# EAGLE design Combined MXP board (EAGLE 7.1.0)
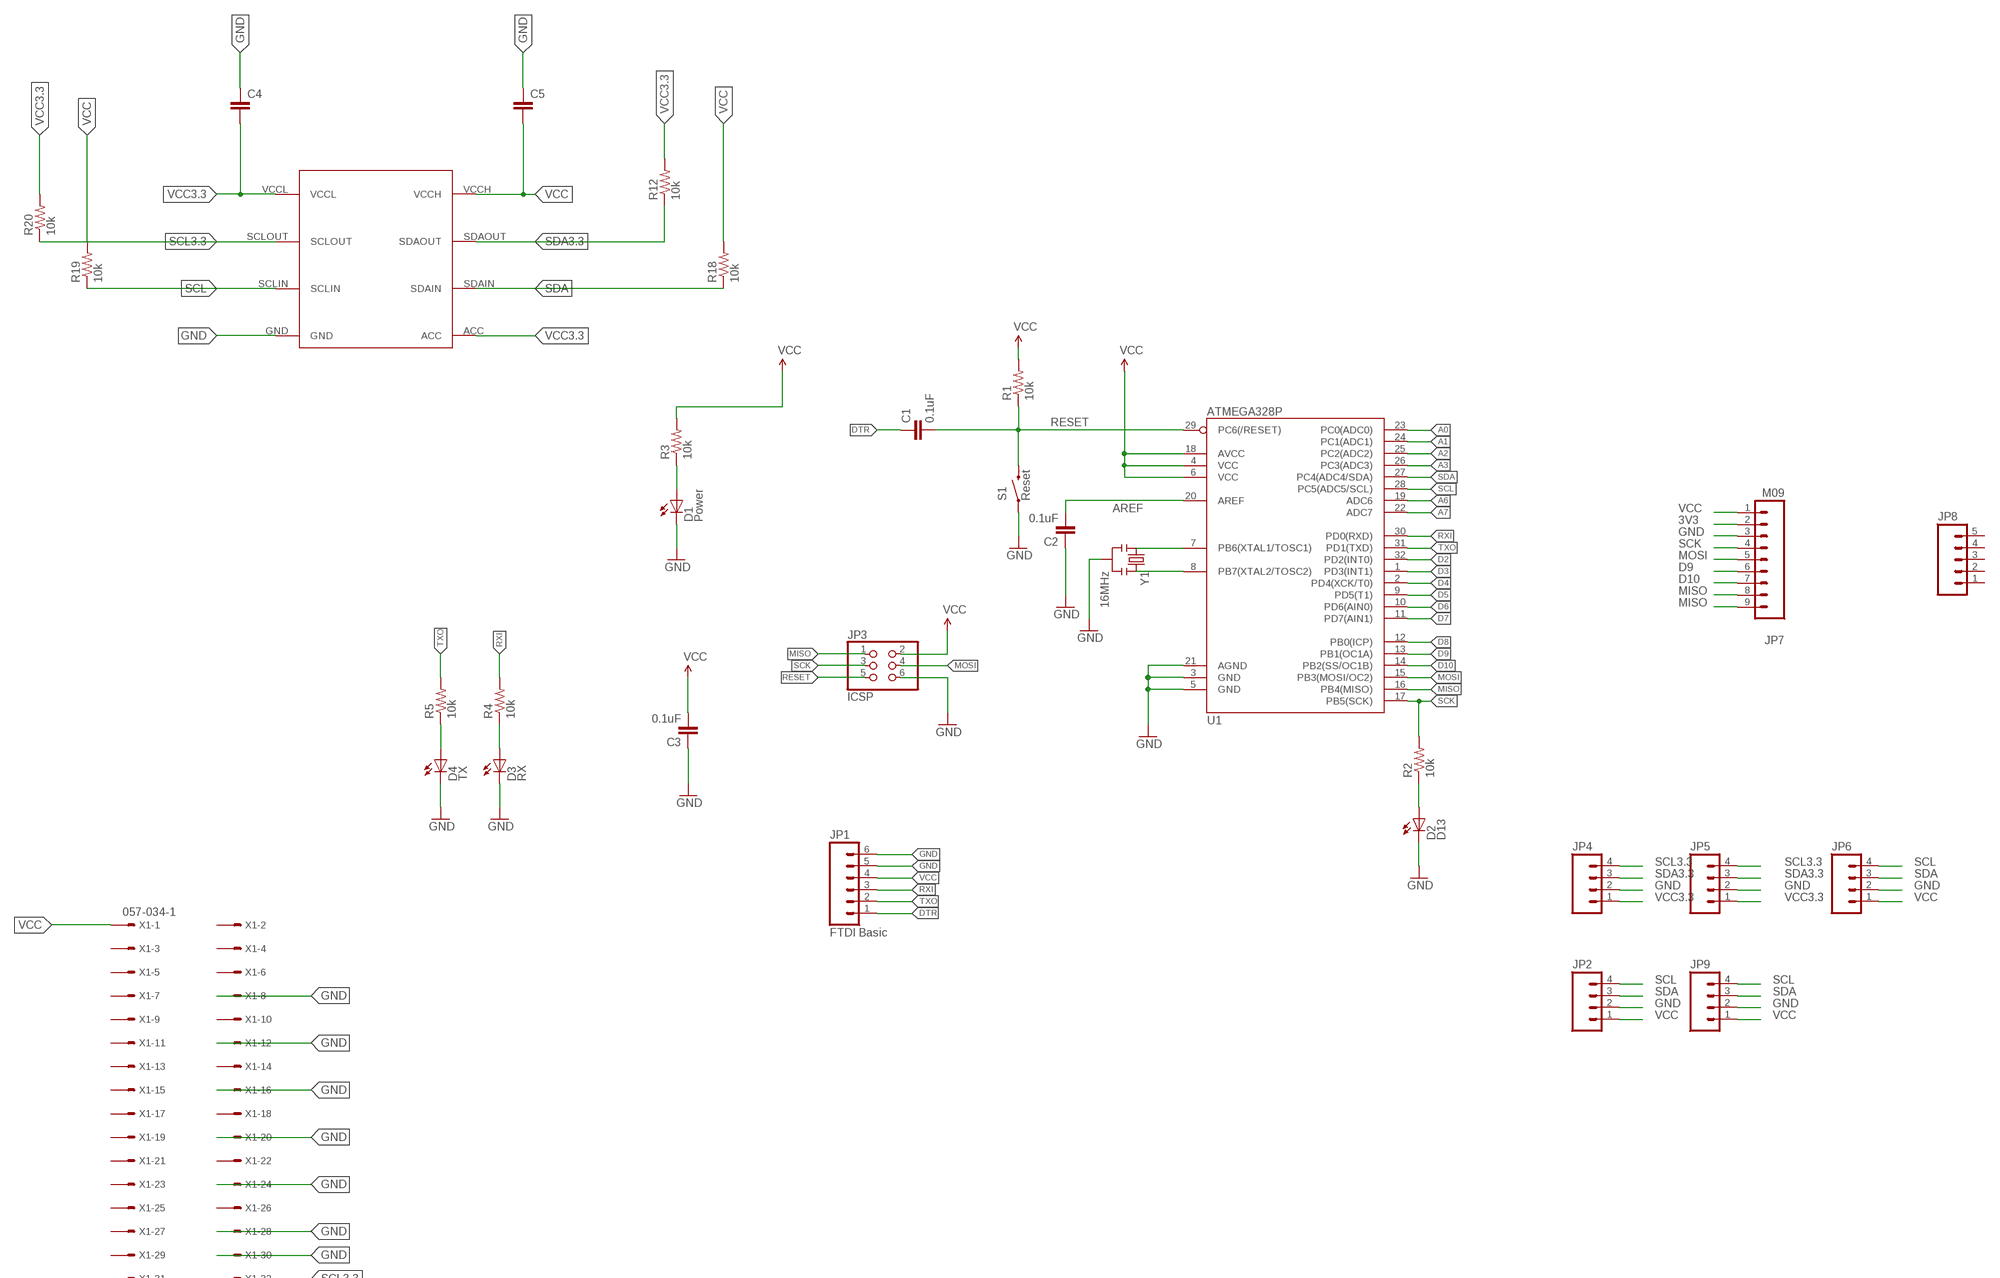
[diagram p0: schematic, sheet 1, part 1 of 2]
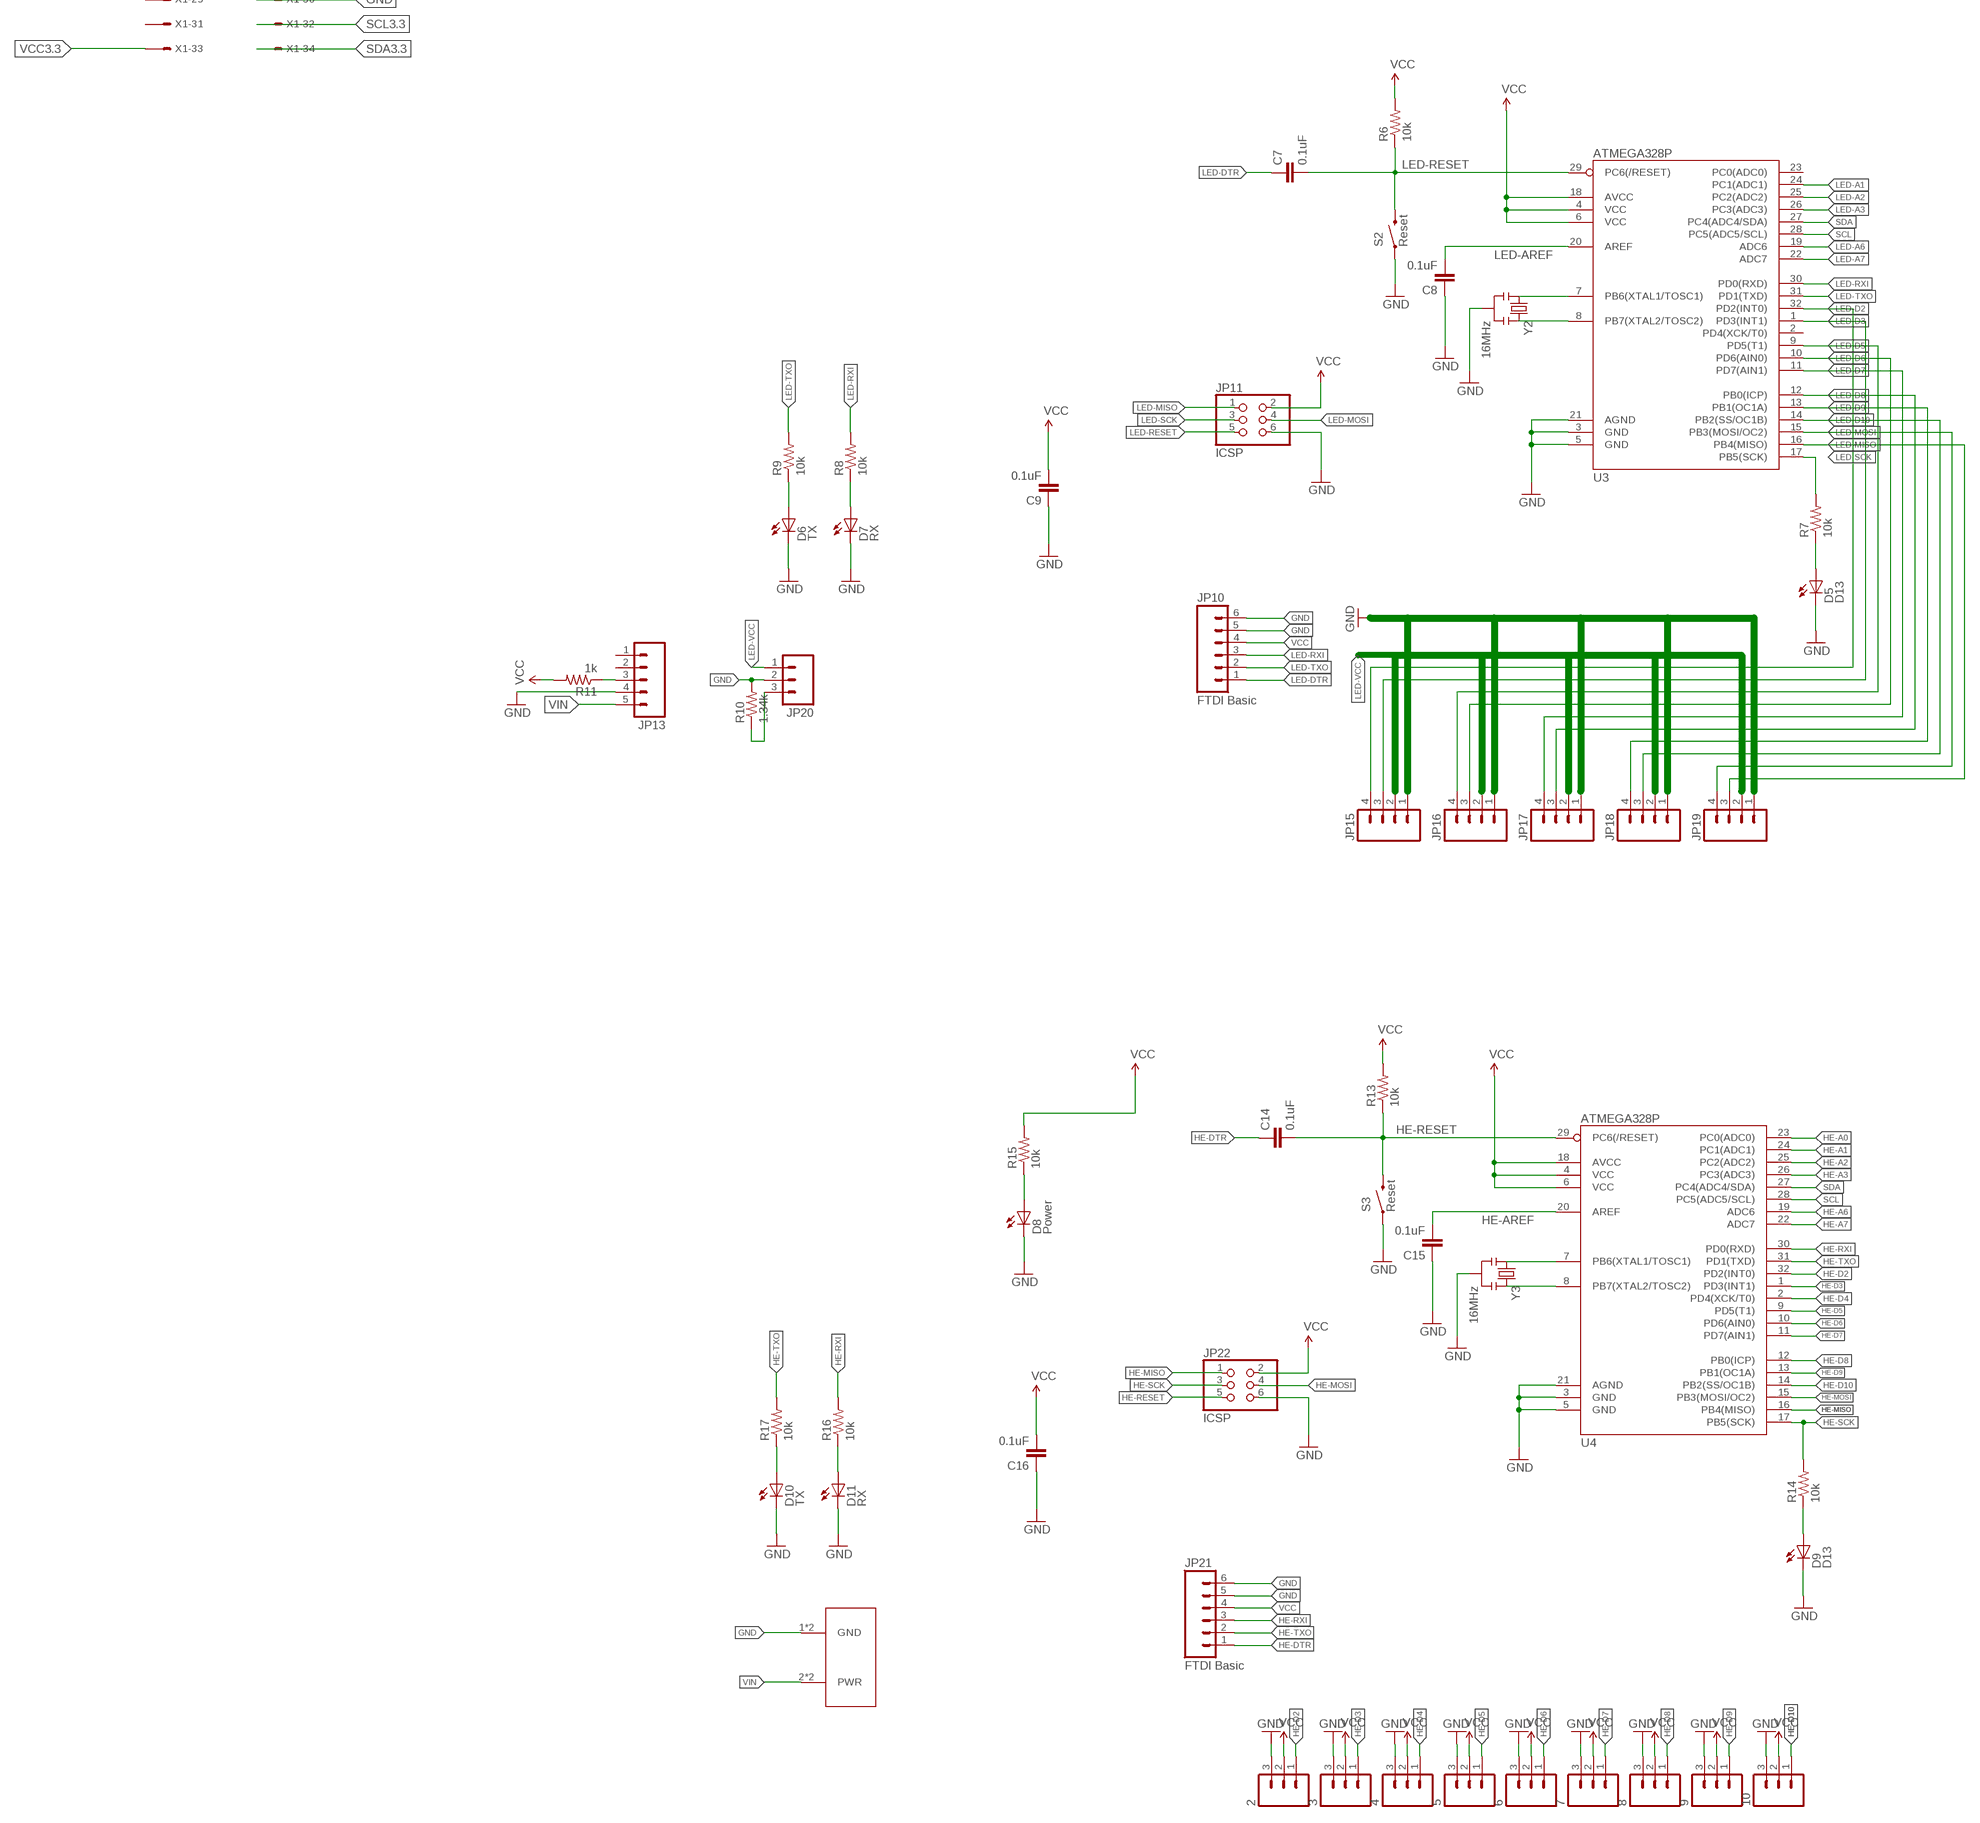
[diagram p1: schematic, sheet 1, part 2 of 2]

## Parts
2  M03PTH  [1X03]
3  M03PTH  [1X03]
4  M03PTH  [1X03]
5  M03PTH  [1X03]
6  M03PTH  [1X03]
7  M03PTH  [1X03]
8  M03PTH  [1X03]
9  M03PTH  [1X03]
10  M03PTH  [1X03]
C1  0.1uF  CAP0603-CAP  [0603-CAP]
C2  0.1uF  CAP0603-CAP  [0603-CAP]
C3  0.1uF  CAP0603-CAP  [0603-CAP]
C4  CAP0402-CAP  [0402-CAP]
C5  CAP0402-CAP  [0402-CAP]
C7  0.1uF  CAP0603-CAP  [0603-CAP]
C8  0.1uF  CAP0603-CAP  [0603-CAP]
C9  0.1uF  CAP0603-CAP  [0603-CAP]
C14  0.1uF  CAP0603-CAP  [0603-CAP]
C15  0.1uF  CAP0603-CAP  [0603-CAP]
C16  0.1uF  CAP0603-CAP  [0603-CAP]
D1  Power  LED-RED0603  [LED-0603]
D2  D13  LED-RED0603  [LED-0603]
D3  RX  LED-GREEN0603  [LED-0603]
D4  TX  LED-RED0603  [LED-0603]
D5  D13  LED-RED0603  [LED-0603]
D6  TX  LED-RED0603  [LED-0603]
D7  RX  LED-GREEN0603  [LED-0603]
D8  Power  LED-RED0603  [LED-0603]
D9  D13  LED-RED0603  [LED-0603]
D10  TX  LED-RED0603  [LED-0603]
D11  RX  LED-GREEN0603  [LED-0603]
JP1  FTDI Basic  M06SIP  [1X06]
JP2  M04PTH  [1X04]
JP3  ICSP  PINHD-2X3  [2X03]
JP4  M04PTH  [1X04]
JP5  M04PTH  [1X04]
JP6  M04PTH  [1X04]
JP7  M09  [1X09]
JP8  M05PTH  [1X05]
JP9  M04PTH  [1X04]
JP10  FTDI Basic  M06SIP  [1X06]
JP11  ICSP  PINHD-2X3  [2X03]
JP13  M05PTH  [1X05]
JP15  M04PTH  [1X04]
JP16  M04PTH  [1X04]
JP17  M04PTH  [1X04]
JP18  M04PTH  [1X04]
JP19  M04PTH  [1X04]
JP20  M03PTH  [1X03]
JP21  FTDI Basic  M06SIP  [1X06]
JP22  ICSP  PINHD-2X3  [2X03]
R1  10k  RESISTOR0603-RES  [0603-RES]
R2  10k  RESISTOR0603-RES  [0603-RES]
R3  10k  RESISTOR0603-RES  [0603-RES]
R4  10k  RESISTOR0603-RES  [0603-RES]
R5  10k  RESISTOR0603-RES  [0603-RES]
R6  10k  RESISTOR0603-RES  [0603-RES]
R7  10k  RESISTOR0603-RES  [0603-RES]
R8  10k  RESISTOR0603-RES  [0603-RES]
R9  10k  RESISTOR0603-RES  [0603-RES]
R10  1.34k  RESISTORAXIAL-0.3  [AXIAL-0.3]
R11  1k  RESISTORAXIAL-0.3  [AXIAL-0.3]
R12  10k  RESISTOR0603-RES  [0603-RES]
R13  10k  RESISTOR0603-RES  [0603-RES]
R14  10k  RESISTOR0603-RES  [0603-RES]
R15  10k  RESISTOR0603-RES  [0603-RES]
R16  10k  RESISTOR0603-RES  [0603-RES]
R17  10k  RESISTOR0603-RES  [0603-RES]
R18  10k  RESISTOR0603-RES  [0603-RES]
R19  10k  RESISTOR0603-RES  [0603-RES]
R20  10k  RESISTOR0603-RES  [0603-RES]
S1  Reset  SWITCH-MOMENTARY-2SMD  [TACTILE_SWITCH_SMD]
S2  Reset  SWITCH-MOMENTARY-2SMD  [TACTILE_SWITCH_SMD]
S3  Reset  SWITCH-MOMENTARY-2SMD  [TACTILE_SWITCH_SMD]
U1  ATMEGA328P  ATMEGA328_SMT  [TQFP32-08]
U3  ATMEGA328P  ATMEGA328_SMT  [TQFP32-08]
U4  ATMEGA328P  ATMEGA328_SMT  [TQFP32-08]
U$1  PCA9512A  [PCA9512A]
U$2  LSF-SMT  [LSF-SMT]
X1  057-034-1  [057-034-1]
Y1  16MHz  RESONATOR16MHZ  [RESONATOR-SMD]
Y2  16MHz  RESONATOR16MHZ  [RESONATOR-SMD]
Y3  16MHz  RESONATOR16MHZ  [RESONATOR-SMD]

## Nets
3V3: JP7.2
A0: U1.23(PC0(ADC0))
A1: U1.24(PC1(ADC1))
A2: U1.25(PC2(ADC2))
A3: U1.26(PC3(ADC3))
A6: U1.19(ADC6)
A7: U1.22(ADC7)
AREF: C2.2 U1.20(AREF)
D2: U1.32(PD2(INT0))
D3: U1.1(PD3(INT1))
D4: U1.2(PD4(XCK/T0))
D5: U1.9(PD5(T1))
D6: U1.10(PD6(AIN0))
D7: U1.11(PD7(AIN1))
D8: U1.12(PB0(ICP))
D9: JP7.6 U1.13(PB1(OC1A))
D10: JP7.7 U1.14(PB2(SS/OC1B))
DTR: C1.1 JP1.1
GND: 2.3 3.3 4.3 5.3 6.3 7.3 8.3 9.3 10.3 C2.1 C3.1 C4.1 C5.1 C8.1 C9.1 C15.1 C16.1 D1.C D2.C D3.C D4.C D5.C D6.C D7.C D8.C D9.C D10.C D11.C JP1.5 JP1.6 JP2.2 JP3.6 JP4.2 JP5.2 JP6.2 JP7.3 JP9.2 JP10.5 JP10.6 JP11.6 JP13.4 JP15.1 JP16.1 JP17.1 JP18.1 JP19.1 JP20.2 JP21.5 JP21.6 JP22.6 R10.P$2 S1.1 S2.1 S3.1 U1.3(GND) U1.5(GND) U1.21(AGND) U3.3(GND) U3.5(GND) U3.21(AGND) U4.3(GND) U4.5(GND) U4.21(AGND) U$1.GND U$2.1(GND) U$2.1-2(GND) X1.8 X1.12 X1.16 X1.20 X1.24 X1.28 X1.30 Y1.2 Y2.2 Y3.2
HE-A0: U4.23(PC0(ADC0))
HE-A1: U4.24(PC1(ADC1))
HE-A2: U4.25(PC2(ADC2))
HE-A3: U4.26(PC3(ADC3))
HE-A6: U4.19(ADC6)
HE-A7: U4.22(ADC7)
HE-AREF: C15.2 U4.20(AREF)
HE-D2: 2.1 U4.32(PD2(INT0))
HE-D3: 3.1 U4.1(PD3(INT1))
HE-D4: 4.1 U4.2(PD4(XCK/T0))
HE-D5: 5.1 U4.9(PD5(T1))
HE-D6: 6.1 U4.10(PD6(AIN0))
HE-D7: 7.1 U4.11(PD7(AIN1))
HE-D8: 8.1 U4.12(PB0(ICP))
HE-D9: 9.1 U4.13(PB1(OC1A))
HE-D10: 10.1 U4.14(PB2(SS/OC1B))
HE-DTR: C14.1 JP21.1
HE-MISO: JP22.1 U4.16(PB4(MISO))
HE-MOSI: JP22.4 U4.15(PB3(MOSI/OC2))
HE-RESET: C14.2 JP22.5 R13.1 S3.3 U4.29(PC6(/RESET))
HE-RXI: JP21.3 R16.2 U4.30(PD0(RXD))
HE-SCK: JP22.3 R14.2 U4.17(PB5(SCK))
HE-TXO: JP21.2 R17.2 U4.31(PD1(TXD))
LED-A1: U3.24(PC1(ADC1))
LED-A2: U3.25(PC2(ADC2))
LED-A3: U3.26(PC3(ADC3))
LED-A6: U3.19(ADC6)
LED-A7: U3.22(ADC7)
LED-AREF: C8.2 U3.20(AREF)
LED-D2: JP15.4 U3.32(PD2(INT0))
LED-D3: JP15.3 U3.1(PD3(INT1))
LED-D5: JP16.4 U3.9(PD5(T1))
LED-D6: JP16.3 U3.10(PD6(AIN0))
LED-D7: JP17.4 U3.11(PD7(AIN1))
LED-D8: JP17.3 U3.12(PB0(ICP))
LED-D9: JP18.4
LED-D10: JP18.3 U3.14(PB2(SS/OC1B))
LED-DTR: C7.1 JP10.1
LED-MISO: JP11.1 JP19.3 U3.16(PB4(MISO))
LED-MOSI: JP11.4 JP19.4 U3.15(PB3(MOSI/OC2))
LED-RESET: C7.2 JP11.5 R6.1 S2.3 U3.29(PC6(/RESET))
LED-RXI: JP10.3 R8.2 U3.30(PD0(RXD))
LED-SCK: JP11.3 R7.2 U3.17(PB5(SCK))
LED-TXO: JP10.2 R9.2 U3.31(PD1(TXD))
LED-VCC: JP15.2 JP16.2 JP17.2 JP18.2 JP19.2 JP20.1
MISO: JP3.1 JP7.8 JP7.9 U1.16(PB4(MISO))
MOSI: JP3.4 JP7.5 U1.15(PB3(MOSI/OC2))
N$1: U1.7(PB6(XTAL1/TOSC1)) Y1.1
N$2: U1.8(PB7(XTAL2/TOSC2)) Y1.3
N$3: D1.A R3.1
N$4: D2.A R2.1
N$5: D3.A R4.1
N$6: D4.A R5.1
N$7: U3.7(PB6(XTAL1/TOSC1)) Y2.1
N$8: U3.8(PB7(XTAL2/TOSC2)) Y2.3
N$9: D5.A R7.1
N$10: D6.A R9.1
N$11: D7.A R8.1
N$12: JP20.3 R10.P$1
N$13: U3.13(PB1(OC1A))
N$14: JP13.3 R11.P$1
N$19: U4.7(PB6(XTAL1/TOSC1)) Y3.1
N$20: U4.8(PB7(XTAL2/TOSC2)) Y3.3
N$21: D8.A R15.1
N$22: D9.A R14.1
N$23: D10.A R17.1
N$24: D11.A R16.1
RESET: C1.2 JP3.5 R1.1 S1.3 U1.29(PC6(/RESET))
RXI: JP1.3 R4.2 U1.30(PD0(RXD))
SCK: JP3.3 JP7.4 R2.2 U1.17(PB5(SCK))
SCL: JP2.4 JP6.4 JP9.4 R19.1 U1.28(PC5(ADC5/SCL)) U3.28(PC5(ADC5/SCL)) U4.28(PC5(ADC5/SCL)) U$1.SCLIN
SCL3.3: JP4.4 JP5.4 R20.1 U$1.SCLOUT X1.32
SDA: JP2.3 JP6.3 JP9.3 R18.1 U1.27(PC4(ADC4/SDA)) U3.27(PC4(ADC4/SDA)) U4.27(PC4(ADC4/SDA)) U$1.SDAIN
SDA3.3: JP4.3 JP5.3 R12.1 U$1.SDAOUT X1.34
TXO: JP1.2 R5.2 U1.31(PD1(TXD))
VCC: 2.2 3.2 4.2 5.2 6.2 7.2 8.2 9.2 10.2 C3.2 C5.2 C9.2 C16.2 JP1.4 JP2.1 JP3.2 JP6.1 JP7.1 JP9.1 JP10.4 JP11.2 JP21.4 JP22.2 R1.2 R3.2 R6.2 R11.P$2 R13.2 R15.2 R18.2 R19.2 U1.4(VCC) U1.6(VCC) U1.18(AVCC) U3.4(VCC) U3.6(VCC) U3.18(AVCC) U4.4(VCC) U4.6(VCC) U4.18(AVCC) U$1.VCCH X1.1
VCC3.3: C4.2 JP4.1 JP5.1 R12.2 R20.2 U$1.ACC U$1.VCCL X1.33
VIN: JP13.5 U$2.2(PWR) U$2.2-2(PWR)
Unconnected: JP8.1 JP8.2 JP8.3 JP8.4 JP8.5 JP13.1 JP13.2 U3.2(PD4(XCK/T0)) U3.23(PC0(ADC0)) X1.2 X1.3 X1.4 X1.5 X1.6 X1.7 X1.9 X1.10 X1.11 X1.13 X1.14 X1.15 X1.17 X1.18 X1.19 X1.21 X1.22 X1.23 X1.25 X1.26 X1.27 X1.29 X1.31

## Library data of the parts
2-10 JP20 = SparkFun-Connectors:M03: Header 3 Standard 3-pin 0.1" header. Use with straight break away headers (SKU : PRT-00116), right angle break away headers (PRT-00553), swiss pins (PRT-00743), machine pins (PRT-00117), and female headers (PRT-00115). Molex polarized connector foot print use with SKU : PRT-08232 with associated crimp pins and housings.
C1-C3 C7-C9 C14-C16 = SparkFun-Passives:CAP: Capacitor Standard 0603 ceramic capacitor, and 0.1" leaded capacitor.
C4 C5 = SparkFun-Capacitors:CAP: Capacitor Standard 0603 ceramic capacitor, and 0.1" leaded capacitor.
D1 D2 D4-D6 D8-D10 = SparkFun-LED:LED-RED: Assorted Red LEDs LilyPad 1206- DIO-09912 1206- DIO-00809 0603- DIO-00819; PROD_ID: DIO-00819; VALUE: RED
D3 D7 D11 = SparkFun-LED:LED-GREEN: Various green LEDs Green LEDs used in SFE Production 0603- DIO-00821 LARGE- DIO-00862 LILYPAD- DIO-09910; PROD_ID: DIO-00821; VALUE: GREEN
JP1 JP10 JP21 = SparkFun-Connectors:M06: Header 6 Standard 6-pin 0.1" header. Use with straight break away headers (SKU : PRT-00116), right angle break away headers (PRT-00553), swiss pins (PRT-00743), machine pins (PRT-00117), and female headers (PRT-00115). Molex polarized connector foot print use with SKU : PRT-08094 with associated crimp pins and housings. NOTES ON THE VARIANTS LOCK and LOCK_LONGPADS... This footprint was designed to help hold the alignment of a through-hole component (i.e. 6-pin header) while soldering it into place. You may notice that each hole has been shifted either up or down by 0.005 of an inch from it's more standard position (which is a perfectly straight line). This slight alteration caused the pins (the squares in the middle) to touch the edges of the holes. Because they are alternating, it causes a "brace" to hold the component in place. 0.005 has proven to be the perfect amount of "off-center" position when using our standard breakaway headers. Although looks a little odd when you look at the bare footprint, once you have a header in there, the alteration is very hard to notice. Also,if you push a header all the way into place, it is covered up entirely on the bottom side. This idea of altering the position of holes to aid alignment will be further integrated into the Sparkfun Library for other footprints. It can help hold any component with 3 or more connection pins.
JP2 JP4-JP6 JP9 JP15-JP19 = SparkFun-Connectors:M04: Header 4 Standard 4-pin 0.1" header. Use with straight break away headers (SKU : PRT-00116), right angle break away headers (PRT-00553), swiss pins (PRT-00743), machine pins (PRT-00117), and female headers (PRT-00115). Molex polarized connector foot print use with SKU : PRT-08231 with associated crimp pins and housings. 1MM SMD Version SKU: PRT-10208
JP3 JP11 JP22 = SparkFun-Connectors:PINHD-2X3: PIN HEADER
JP7 = SparkFun-Connectors:M09: Header 9 Standard 9-pin 0.1" header. Use with straight break away headers (SKU : PRT-00116), right angle break away headers (PRT-00553), swiss pins (PRT-00743), machine pins (PRT-00117), and female headers (PRT-00115).
JP8 JP13 = SparkFun-Connectors:M05: Header 5 Standard 5-pin 0.1" header. Use with straight break away headers (SKU : PRT-00116), right angle break away headers (PRT-00553), swiss pins (PRT-00743), machine pins (PRT-00117), and female headers (PRT-00115). Molex polarized connector foot print use with SKU : PRT-08230 with associated crimp pins and housings.
R1-R9 R12-R20 = SparkFun-Passives:RESISTOR: Resistor Basic schematic elements and footprints for 0603, 1206, and PTH resistors.
R10 R11 = SparkFun-Resistors:RESISTOR: Resistor Basic schematic elements and footprints for 0603, 1206, and PTH resistors.
S1-S3 = SparkFun-Electromechanical:SWITCH-MOMENTARY-2: Various NO switches- pushbuttons, reed, etc; PROD_ID: SWCH-08247
U1 U3 U4 = SparkFun-DigitalIC:ATMEGA328_SMT: 32-Pin Atmega328 part Commonly used on Arduino compatible boards Available in QFP and QFN packages TQFP is IC-09069 QFN is non-stock; PROD_ID: IC-09069
U$1 = TPS5430:PCA9512A
U$2 = LSF-SMT:LSF-SMT
X1 = con-panduit:057-034-: CONNECTOR 34-pin series 057 contact pc board low profile headers; OC_FARNELL: unknown; OC_NEWARK: unknown
Y1-Y3 = SparkFun-FreqCtrl:RESONATOR: Resonator Small SMD resonator. Used, eg, on the Arduino Pro/ Pro Mini boards. 8MHz- XTAL-08895 16MHz- XTAL-08900; PROD_ID: XTAL-08900

## Board
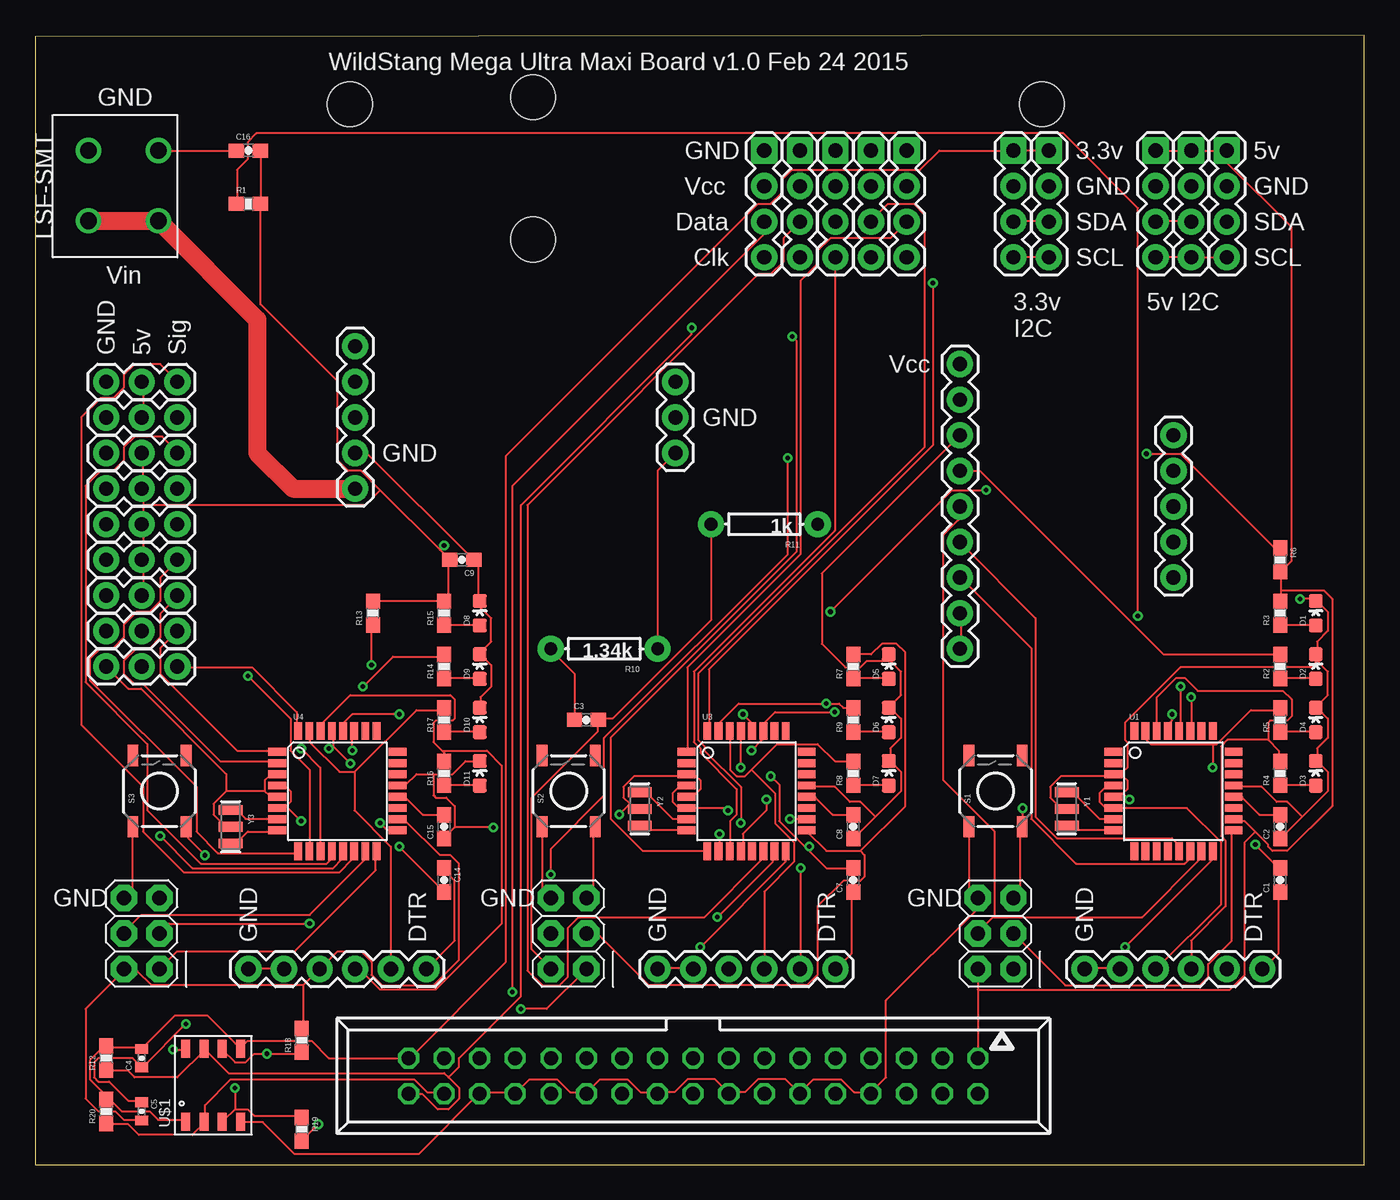
[diagram p2: board, top side]
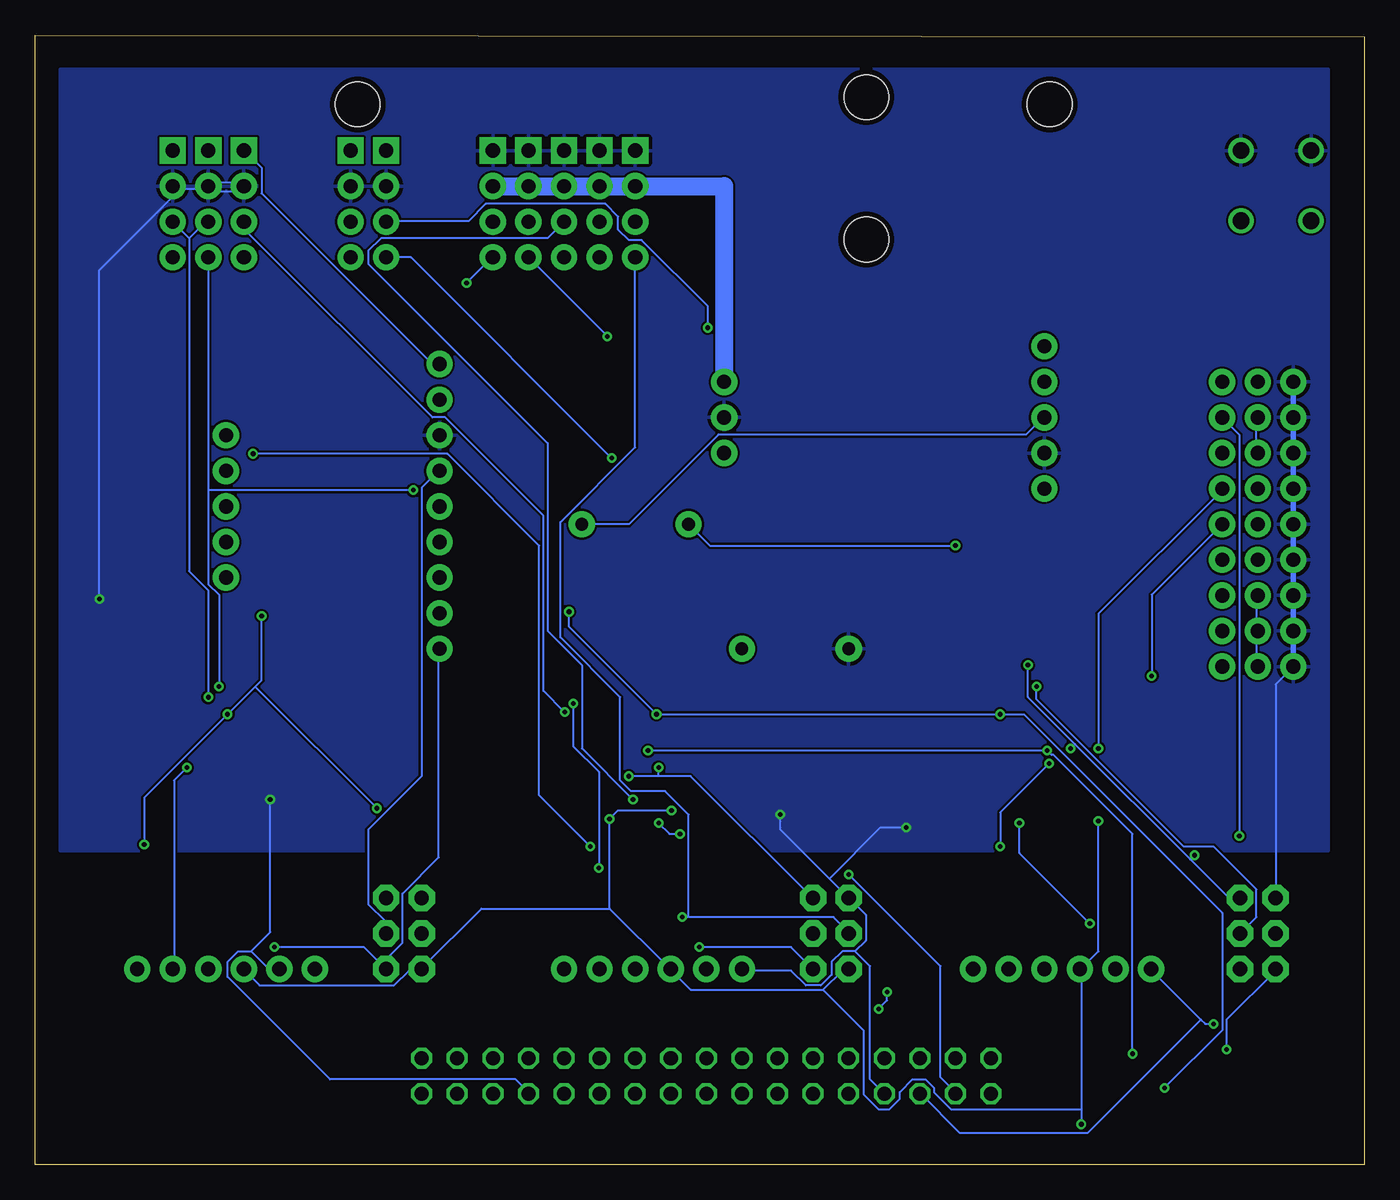
[diagram p3: board, bottom side, seen from below]

Size 94.92 x 80.64 mm. Coordinates in mm from the lower left corner, seen from the top.
Outline: 0,0 94.92,0 94.92,80.64 0,80.51 0,0
Copper layers (1*16): Top 0.0356mm / dielectric 1.5011mm / Bottom 0.0356mm
Design rules "LaenPCBOrder": minimum track width 6mil, minimum drill 13mil, track to track 6mil, track to pad 6mil, pad to pad 6mil, via to via 6mil, smd to smd 6mil, copper to edge 15mil, drill to drill 6mil, minimum pad ring 7mil, minimum via ring 7mil, stop-mask expansion 3mil, vias tented up to drill 0mil, thermal gap 10mil
Holes 3.2 mm at 22.48,75.69 71.88,75.69 35.56,66.04 35.56,76.2

### Footprints (pad centres in the part's own frame; a part is rotated, then mirrored left to right if it is on the bottom)
1X03 = drill 1.016 pad 1.88: 1 0,0; 2 2.54,0; 3 5.08,0
0603-CAP = smd 1.1 x 1: 1 -0.85,0; 2 0.85,0
0402-CAP = smd 0.7 x 0.9: 1 -0.65,0; 2 0.65,0
LED-0603 = smd 1 x 1: A 0,-0.877; C 0,0.877
1X06 = drill 1.016 pad 1.88: 1 0,0; 2 2.54,0; 3 5.08,0; 4 7.62,0; 5 10.16,0; 6 12.7,0
1X04 = drill 1.016 pad 1.88 square: 1 0,0 | drill 1.016 pad 1.88: 2 2.54,0; 3 5.08,0; 4 7.62,0
2X03 = drill 1.016 pad 1.88 octagon: 1 -2.54,-1.27; 2 -2.54,1.27; 3 0,-1.27; 4 0,1.27; 5 2.54,-1.27; 6 2.54,1.27
1X09 = drill 1.016 pad 1.88: 1 0,0; 2 2.54,0; 3 5.08,0; 4 7.62,0; 5 10.16,0; 6 12.7,0; 7 15.24,0; 8 17.78,0; 9 20.32,0
1X05 = drill 1.016 pad 1.88: 1 0,0; 2 2.54,0; 3 5.08,0; 4 7.62,0; 5 10.16,0
0603-RES = smd 1.1 x 1: 1 -0.85,0; 2 0.85,0
AXIAL-0.3 = drill 0.9 pad 1.88: P$1 -3.81,0; P$2 3.81,0
TACTILE_SWITCH_SMD = smd 1.524 x 0.762: 1 -2.54,1.905; 2 2.54,1.905; 3 -2.54,-1.905; 4 2.54,-1.905
TQFP32-08 = smd 1.27 x 0.559: 1 -4.293,2.8; 2 -4.293,2; 3 -4.293,1.2; 4 -4.293,0.4; 5 -4.293,-0.4; 6 -4.293,-1.2; 7 -4.293,-2; 8 -4.293,-2.8; 17 4.293,-2.8; 18 4.293,-2; 19 4.293,-1.2; 20 4.293,-0.4; 21 4.293,0.4; 22 4.293,1.2; 23 4.293,2; 24 4.293,2.8 | smd 0.559 x 1.27: 9 -2.8,-4.293; 10 -2,-4.293; 11 -1.2,-4.293; 12 -0.4,-4.293; 13 0.4,-4.293; 14 1.2,-4.293; 15 2,-4.293; 16 2.8,-4.293; 25 2.8,4.293; 26 2,4.293; 27 1.2,4.293; 28 0.4,4.293; 29 -0.4,4.293; 30 -1.2,4.293; 31 -2,4.293; 32 -2.8,4.293
PCA9512A = smd 1.27 x 0.635: ACC 3.2,-0.7; GND -2,-0.7; SCLIN -2,0.6; SCLOUT -2,1.9; SDAIN 3.2,0.6; SDAOUT 3.2,1.9; VCCH 3.2,3.2; VCCL -2,3.2
LSF-SMT = drill 1.199: 1 0,5.004; 1-2 0,0; 2 5.004,5.004; 2-2 5.004,0
057-034-1 = drill 1 octagon: 1 -20.32,-1.27; 2 -20.32,1.27; 3 -17.78,-1.27; 4 -17.78,1.27; 5 -15.24,-1.27; 6 -15.24,1.27; 7 -12.7,-1.27; 8 -12.7,1.27; 9 -10.16,-1.27; 10 -10.16,1.27; 11 -7.62,-1.27; 12 -7.62,1.27; 13 -5.08,-1.27; 14 -5.08,1.27; 15 -2.54,-1.27; 16 -2.54,1.27; 17 0,-1.27; 18 0,1.27; 19 2.54,-1.27; 20 2.54,1.27; 21 5.08,-1.27; 22 5.08,1.27; 23 7.62,-1.27; 24 7.62,1.27; 25 10.16,-1.27; 26 10.16,1.27; 27 12.7,-1.27; 28 12.7,1.27; 29 15.24,-1.27; 30 15.24,1.27; 31 17.78,-1.27; 32 17.78,1.27; 33 20.32,-1.27; 34 20.32,1.27
RESONATOR-SMD = smd 0.7 x 1.7: 1 -1.2,0; 2 0,0; 3 1.2,0

### Placement (x,y rotation side)
2  10.16,35.56 180 top
3  10.16,38.1 180 top
4  10.16,40.64 180 top
5  10.16,43.18 180 top
6  10.16,45.72 180 top
7  10.16,48.26 180 top
8  10.16,50.8 180 top
9  10.16,53.34 180 top
10  10.16,55.88 180 top
C1  88.9,20.32 90 top
C2  88.9,24.13 90 top
C3  39.37,31.75 0 top
C4  7.62,7.62 90 top
C5  7.62,3.81 270 top
C7  58.42,20.32 90 top
C8  58.42,24.13 90 top
C9  30.48,43.18 180 top
C14  29.21,20.32 270 top
C15  29.21,24.13 90 top
C16  15.24,72.39 0 top
D1  91.44,39.37 0 top
D2  91.44,35.56 0 top
D3  91.44,27.94 0 top
D4  91.44,31.75 0 top
D5  60.96,35.56 0 top
D6  60.96,31.75 0 top
D7  60.96,27.94 0 top
D8  31.75,39.37 0 top
D9  31.75,35.56 0 top
D10  31.75,31.75 0 top
D11  31.75,27.94 0 top
JP1  87.63,13.97 180 top
JP2  80.01,72.39 270 top
JP3  68.58,16.51 90 top
JP4  72.39,72.39 270 top
JP5  69.85,72.39 270 top
JP6  85.09,72.39 270 top
JP7  66.04,57.15 270 top
JP8  81.28,52.07 270 top
JP9  82.55,72.39 270 top
JP10  57.15,13.97 180 top
JP11  38.1,16.51 90 top
JP13  22.86,58.42 270 top
JP15  62.23,72.39 270 top
JP16  59.69,72.39 270 top
JP17  57.15,72.39 270 top
JP18  54.61,72.39 270 top
JP19  52.07,72.39 270 top
JP20  45.72,55.88 270 top
JP21  27.94,13.97 180 top
JP22  7.62,16.51 90 top
R1  15.24,68.58 0 top
R2  88.9,35.56 90 top
R3  88.9,39.37 90 top
R4  88.9,27.94 90 top
R5  88.9,31.75 90 top
R6  88.9,43.18 270 top
R7  58.42,35.56 90 top
R8  58.42,27.94 90 top
R9  58.42,31.75 90 top
R10  40.64,36.83 180 top
R11  52.07,45.72 180 top
R12  5.08,7.62 90 top
R13  24.13,39.37 90 top
R14  29.21,35.56 90 top
R15  29.21,39.37 90 top
R16  29.21,27.94 90 top
R17  29.21,31.75 90 top
R18  19.05,8.89 90 top
R19  19.05,2.54 270 top
R20  5.08,3.81 90 top
S1  68.58,26.67 90 top
S2  38.1,26.67 90 top
S3  8.89,26.67 90 top
U1  81.28,26.67 0 top
U3  50.8,26.67 0 top
U4  21.59,26.67 0 top
U$1  13.97,5.08 90 top
U$2  3.81,72.39 270 top
X1  46.99,6.35 180 top
Y1  73.66,25.4 270 top
Y2  43.18,25.4 270 top
Y3  13.97,24.13 270 top

### Tracks (layer width: path | path; a pad name or v marks a point on that pad's centre or on a via)
AREF
  Top 0.152: C2.2 88.8,24.99 87.43,24.99 86.21,26.21 85.6,26.21 U1.20
D9
  Top 0.152: U1.13 81.64,22.4 81.64,22.86 81.18,23.32 72.95,23.32 71.42,24.84 71.42,39.01 66.09,44.35 JP7.6
D10
  Top 0.152: U1.14 82.4,22.25 82.4,21.79 82.09,21.49 74.32,21.49 71.12,24.69 71.12,36.88 66.09,41.91 JP7.7
DTR
  Top 0.152: C1.1 88.8,19.36 88.8,15.09 87.73,14.02 JP1.1
GND  (via drill 0.33)
  Top 0.152: 61.06,35.97 61.06,36.42 D5.C 61.06,35.97 | 61.06,35.97 61.82,35.2 61.82,33.53 61.06,32.77 D6.C 61.06,32.61 61.82,31.85 61.82,30.48 61.06,29.72 61.06,28.96 D7.C 61.06,28.8 61.82,28.04 61.82,26.67 60,24.84 | 60,24.84 58.47,23.32 C8.1 | 60,24.84 58.93,25.91 58.17,25.91 57.1,26.98 55.12,26.98 U3.21 | JP22.6 6.96,19.66 6.96,24.08 S3.1 | D10.C 31.8,32.77 31.8,33.38 32.56,34.14 32.56,35.66 31.8,36.42 D9.C 31.8,36.58 32.56,37.34 32.56,39.01 31.8,39.78 31.8,40.23 D8.C 31.65,40.39 31.65,42.82 31.34,43.13 C9.1 31.19,43.28 23.72,50.75 22.96,50.75 JP13.4 | 16.41,26.67 16.71,26.36 17.17,26.36 U4.5 | 16.41,26.67 16.41,27.43 16.71,27.74 17.17,27.74 U4.3 | 13.67,26.67 12.75,25.76 12.75,24.99 13.51,24.23 13.97,24.23 Y3.2 | 16.41,26.67 13.67,26.67 | C3.1 38.51,31.85 38.51,35.05 36.83,36.73 R10.P$2 | U$2.1 C16.1 | 13.67,26.67 13.67,27.89 7.57,33.98 6.65,33.98 2.3 | 61.06,35.97 59.39,35.97 58.93,35.51 57.86,35.51 56.19,37.19 56.19,42.22 JP7.3 | 28.45,27.89 27.23,27.89 26.47,27.13 26.01,27.13 U4.21 | 28.45,27.89 29.82,27.89 30.73,28.8 31.65,28.8 D11.C | 29.97,24.08 29.21,23.32 C15.1 | 29.97,24.08 29.97,25.6 29.36,26.21 28.6,26.21 28.45,26.36 28.45,27.89 | JP10.6 44.45,14.02 46.89,14.02 JP10.5 | U3.5 46.58,26.36 47.04,26.36 47.5,26.82 47.5,27.43 47.19,27.74 46.58,27.74 U3.3 46.43,27.74 42.77,27.74 42.01,26.98 42.01,26.21 42.47,25.76 | 42.47,25.76 42.77,25.45 43.08,25.45 Y2.2 | JP11.6 36.22,19.66 36.22,24.08 S2.1 | v41.71,24.99 42.47,25.76 | v32.72,24.08 29.97,24.08 | C5.1 7.57,4.57 6.65,4.57 5.28,5.94 4.52,5.94 4.22,6.25 4.22,7.32 4.52,7.62 6.96,7.62 7.57,7.01 C4.1 7.72,7.01 v10.77,10.06
  Top 0.152: JP21.5 17.78,14.02 15.34,14.02 JP21.6 | U$1.GND 14.73,3.05 16.26,3.05 18.54,0.76 27.38,0.76 31.65,5.03 X1.30 31.8,5.18 34.24,5.18 X1.28 35.31,6.1 37.29,6.1 38.2,5.18 39.27,5.18 X1.24 39.42,5.18 40.34,6.1 42.32,6.1 43.23,5.18 44.45,5.18 | 77.67,26.52 77.98,26.82 77.98,27.43 77.67,27.74 | 77.67,26.52 77.52,26.36 77.06,26.36 U1.5 | 77.67,27.74 77.06,27.74 U1.3 76.91,27.74 73.25,27.74 72.49,26.98 72.49,26.21 73.25,25.45 73.56,25.45 Y1.2 | D2.C 91.54,36.58 91.54,37.34 92.3,38.1 92.3,39.47 91.54,40.23 D1.C 91.39,40.39 v90.32,40.39 | 90.48,24.84 92.3,26.67 92.3,28.04 91.54,28.8 D3.C 91.54,28.96 91.54,29.72 92.3,30.48 92.3,31.85 91.54,32.61 D4.C 91.54,32.77 92.3,33.53 92.3,35.2 91.54,35.97 | 90.48,24.84 88.95,23.32 C2.1 | 90.48,24.84 89.41,25.91 88.65,25.91 87.58,26.98 85.6,26.98 U1.21 | 91.54,35.97 91.54,36.42 D2.C | 77.67,27.74 77.67,28.04 77.98,28.35 77.98,30.18 77.83,30.33 77.83,31.55 81.79,35.51 91.08,35.51 91.54,35.97 | 91.54,35.97 D2.C | S1.1 66.7,24.08 66.7,19.66 JP3.6 67.31,18.29 60.76,11.73 60.76,6.25 59.69,5.18 | JP1.6 74.93,14.02 77.37,14.02 JP1.5 | 59.69,5.18 58.47,5.18 57.56,6.1 55.58,6.1 54.66,5.18 X1.12 53.59,6.1 51.61,6.1 50.7,5.18 49.63,5.18 X1.16 49.48,5.18 48.57,6.1 46.58,6.1 45.67,5.18 44.45,5.18 | 59.69,5.18 X1.8 | v78.13,26.06 77.67,26.52 | 44.45,5.18 X1.20
  Bottom 0.152: JP22.6 6.35,34.29 2.3 | v41.71,24.99 41.71,23.93 38.2,20.42 | 38.2,20.42 JP11.6 35.61,17.83 35.61,16 36.37,15.24 | 36.37,15.24 37.29,15.24 38.05,14.48 38.05,13.56 38.81,12.8 39.88,12.8 40.95,13.87 44.45,13.87 JP10.6 | v32.72,24.08 34.54,24.08 38.2,20.42 | v10.77,10.06 11.38,10.06 11.68,10.36 | 11.68,10.36 15.19,13.87 JP21.6 | 11.68,10.36 19.76,2.29 28.91,2.29 31.65,5.03 X1.30 | 36.37,15.24 35.31,14.17 35.31,6.1 X1.28 | 79.5,15.24 78.28,14.02 77.52,14.02 JP1.5 | 79.5,15.24 80.42,15.24 81.18,14.48 81.18,13.41 73.86,6.1 60.6,6.1 59.69,5.18 X1.8 | v78.13,26.06 78.13,16.61 79.5,15.24 | v90.32,40.39 90.32,63.86 84.53,69.65 82.7,69.65 82.55,69.49 79.96,69.49 79.81,69.65 79.81,70.1 82.09,70.1 82.25,70.26 82.55,70.26 82.7,70.1 82.7,69.8 82.55,69.8 JP9.2
  Bottom 0.406: 2.3 3.3 10.3
  pour Bottom: 2.59,78.18 93.12,78.18 93.12,22.4 2.59,22.4
HE-AREF
  Top 0.152: C15.2 29.21,24.99 27.69,24.99 26.47,26.21 26.01,26.21 U4.20
HE-D2
  Top 0.152: U4.32 18.69,31.09 18.69,32.31 15.49,35.51 10.16,35.51 2.1
HE-D3
  Top 0.152: 3.1 8.94,36.88 8.94,35.05 14.43,29.57 17.17,29.57 U4.1
HE-D4
  Top 0.152: U4.2 17.17,28.8 13.21,28.8 7.72,34.29 7.11,34.29 6.35,35.05 6.35,35.97 7.26,36.88 8.18,36.88 8.94,37.64 8.94,39.32 10.16,40.54 4.1
HE-D5
  Top 0.152: U4.9 18.69,22.25 13.06,22.25 11.53,23.77 11.53,26.98 3.91,34.59 3.91,36.12 4.67,36.88 5.59,36.88 6.35,37.64 6.35,38.56 7.26,39.47 8.18,39.47 8.94,40.23 8.94,41.91 10.16,43.13 5.1
HE-D6  (via drill 0.33)
  Top 0.152: v15.19,34.9 18.24,31.85 18.24,29.57 19.61,28.19 19.61,22.4 U4.10
  Bottom 0.152: v15.19,34.9 15.19,40.69 6.1
HE-D7  (via drill 0.33)
  Top 0.152: v19,29.72 20.37,28.35 20.37,22.4 U4.11
  Bottom 0.152: v19,29.72 19,39.32 10.16,48.16 7.1
HE-D8
  Top 0.152: U4.12 21.13,22.25 21.13,21.79 20.83,21.49 11.84,21.49 8.03,25.3 8.03,30.02 3.61,34.44 3.61,48.46 4.67,49.53 5.59,49.53 6.35,50.29 6.35,51.21 7.11,51.97 9.09,51.97 10.16,50.9 8.1
HE-D9  (via drill 0.33)
  Top 0.152: v8.94,23.47 11.23,21.18 21.28,21.18 21.9,21.79 21.9,22.25 U4.13
  Bottom 0.152: v8.94,23.47 8.94,52.12 9.1
HE-D10
  Top 0.152: U4.14 22.66,22.25 22.66,21.79 21.74,20.88 10.62,20.88 7.72,23.77 7.72,26.98 3.3,31.39 3.3,53.34 4.67,54.71 5.59,54.71 6.35,55.47 6.35,56.39 7.11,57.15 8.94,57.15 10.16,55.93 10.1
HE-DTR
  Top 0.152: JP21.1 29.97,16 29.97,20.27 29.21,21.03 C14.1
HE-MISO
  Top 0.152: JP22.1 10.16,15.24 18.54,15.24 24.33,21.03 24.33,22.25 U4.16
HE-MOSI
  Top 0.152: U4.15 23.57,22.25 23.57,21.79 19.61,17.83 7.57,17.83 6.35,16.61 JP22.4
HE-RESET  (via drill 0.33)
  Top 0.152: v26.01,22.71 29.21,19.51 C14.2 | 21.28,29.87 v22.5,28.65 | 21.28,29.87 21.28,30.94 U4.29 | v24.03,35.66 24.03,38.41 R13.1 | v12.14,22.1 10.92,23.32 10.92,24.08 S3.3 | 21.28,29.87 21.13,29.87 v20.98,29.72
  Bottom 0.152: v26.01,22.71 26.01,25.15 v22.5,28.65 | v24.03,35.66 24.03,33.38 20.68,30.02 | 12.45,21.79 9.7,19.05 JP22.5 | 12.45,21.79 20.68,30.02 | 12.45,21.79 v12.14,22.1 | 20.68,30.02 v20.98,29.72
HE-RXI
  Top 0.152: R16.2 29.21,29.41 29.06,29.57 | 29.06,29.57 28.45,30.18 28.45,31.55 28.6,31.7 29.82,31.7 29.97,31.85 29.97,33.22 29.67,33.53 22.5,33.53 20.52,31.55 20.52,31.09 U4.30 | 29.06,29.57 32.26,29.57 33.33,28.5 33.33,17.22 28.6,12.5 24.64,12.5 23.27,13.87 22.96,13.87 JP21.3
HE-SCK  (via drill 0.33)
  Top 0.152: v23.42,34.14 25.55,36.27 29.21,36.27 R14.2 | v24.64,24.38 25.09,23.93 25.86,23.93 U4.17 | v19.61,17.22 9.55,17.22 8.94,16.61 JP22.3
  Bottom 0.152: v23.42,34.14 23.42,33.22 12.9,22.71 10.77,22.71 7.72,19.66 7.72,17.68 JP22.3 | v24.64,24.38 24.64,22.25 v19.61,17.22
HE-TXO
  Top 0.152: 22.81,28.04 27.23,32.46 29.21,32.46 R17.2 | 22.81,28.04 21.74,28.04 19.61,30.18 19.61,30.94 U4.31 | JP21.2 25.4,22.71 22.81,25.3 22.81,28.04
LED-AREF
  Top 0.152: C8.2 58.32,24.99 56.95,24.99 55.73,26.21 55.12,26.21 U3.20
LED-D2  (via drill 0.33)
  Top 0.152: v64.11,62.94 64.11,51.36 48.11,35.36 48.11,31.09 U3.32
  Bottom 0.152: v64.11,62.94 62.28,64.77 JP15.4
LED-D3
  Top 0.152: JP15.3 61.06,66.14 56.79,66.14 55.88,65.23 55.88,64.31 54.66,63.09 54.66,43.59 46.58,35.51 46.58,29.57 U3.1
LED-D5  (via drill 0.33)
  Top 0.152: v54.05,59.13 54.36,58.83 54.36,43.74 41.1,30.48 41.1,24.69 43.38,22.4 47.95,22.4 U3.9
  Bottom 0.152: JP16.4 v54.05,59.13
LED-D6  (via drill 0.33)
  Top 0.152: v48.87,23.62 48.87,22.4 U3.10 | v50.39,24.38 50.39,26.98 47.8,29.57 47.8,29.87 47.35,30.33 47.35,35.05 63.5,51.21 63.5,67.82 62.74,68.58 60.91,68.58 59.69,67.36 JP16.3
  Bottom 0.152: v48.87,23.62 49.63,23.62 v50.39,24.38
LED-D7
  Top 0.152: U3.11 49.63,22.4 49.63,24.54 50.09,24.99 50.09,26.82 47.5,29.41 47.5,29.72 47.04,30.18 47.04,35.2 57.1,45.26 57.1,64.77 JP17.4
LED-D8  (via drill 0.33)
  Top 0.152: v52.22,26.06 52.22,25.3 50.55,23.62 50.55,22.4 U3.12
  Bottom 0.152: v52.22,26.06 55.88,29.72 55.88,35.66 58.32,38.1 58.32,51.51 71.12,64.31 71.12,65.23 70.21,66.14 58.32,66.14 JP17.3
LED-D10
  Top 0.152: JP18.3 53.44,66.14 53.44,64.47 52.53,63.55 51.61,63.55 35.15,47.09 35.15,13.87 36.22,12.8 37.44,12.8 38.05,13.41 38.05,16.92 38.81,17.68 47.8,17.68 51.92,21.79 51.92,22.25 U3.14
LED-DTR
  Top 0.152: C7.1 58.32,19.36 58.32,15.09 57.25,14.02 JP10.1
LED-MISO  (via drill 0.33)
  Top 0.152: v47.5,15.54 53.59,21.64 53.59,22.25 U3.16 | JP19.3 52.07,66.45 34.09,48.46 v34.09,12.34 | v34.7,11.12 36.52,11.12 JP11.1
  Bottom 0.152: v47.5,15.54 40.95,15.54 JP11.1 | v34.09,12.34 34.09,11.73 v34.7,11.12
LED-MOSI  (via drill 0.33)
  Top 0.152: v48.72,17.68 52.68,21.64 52.68,22.25 U3.15
  Bottom 0.152: 48.26,17.68 37.9,17.68 36.83,16.61 JP11.4 | 48.26,17.68 v48.72,17.68 | JP19.4 52.07,51.21 57.4,45.87 57.4,37.64 53.14,33.38 53.14,27.43 52.38,26.67 49.94,26.67 48.26,24.99 48.26,17.68
LED-RESET  (via drill 0.33)
  Top 0.152: 55.12,22.55 53.14,24.54 53.14,27.13 v52.53,27.74 | 55.12,22.55 56.49,21.18 58.32,21.18 C7.2 | v79.35,50.75 81.79,50.75 88.49,44.04 88.8,44.04 R6.1 | 55.12,22.55 v55.27,22.71 | v50.39,28.35 50.39,30.94 U3.29 | S2.3 39.88,24.08 39.88,19.51 39.42,19.05 JP11.5
  Bottom 0.152: 50.39,27.74 48.11,27.74 39.42,19.05 JP11.5 | 50.39,27.74 v52.53,27.74 | v79.35,50.75 65.48,50.75 58.93,44.2 58.93,26.36 v55.27,22.71 | 50.39,27.74 v50.39,28.35
LED-RXI
  Top 0.152: 51.16,28.19 50.7,27.74 50.09,27.74 49.63,28.19 49.63,30.94 U3.30 | 51.16,28.19 52.98,30.02 55.88,30.02 57.1,28.8 58.32,28.8 R8.2 | JP10.3 52.07,19.51 54.2,21.64 54.2,23.01 52.83,24.38 52.83,26.52 51.16,28.19
LED-SCK
  Top 0.152: 58.93,22.4 62.13,25.6 62.13,36.58 61.52,37.19 60.45,37.19 59.69,36.42 58.47,36.42 R7.2 | 58.93,22.4 56.49,22.4 55.12,23.77 U3.17 | 58.93,22.4 59.23,22.1 59.23,20.57 58.93,20.27 57.71,20.27 55.88,18.44 55.88,13.56 55.12,12.8 43.84,12.8 40.18,16.46 39.42,16.46 JP11.3
LED-TXO  (via drill 0.33)
  Top 0.152: R9.2 58.32,32.61 57.71,32.61 57.4,32.92 v56.49,32.92 50.24,32.92 48.87,31.55 48.87,31.09 U3.31 | v54.66,21.18 54.66,14.02 JP10.2
  Bottom 0.152: v54.66,21.18 54.66,28.04 56.49,29.87 v56.49,32.92
LED-VCC
  Bottom 0.152: 52.07,69.8 JP19.2 | 54.51,69.85 54.51,69.8 JP18.2 | JP17.2 57.25,69.8 57.25,69.85 | 59.69,69.8 JP16.2
  Bottom 1.27: JP15.2 JP16.2 57.25,69.85 JP17.2 JP18.2 54.51,69.85 JP19.2 45.72,69.85 JP20.1
MISO  (via drill 0.33)
  Top 0.152: JP7.9 66.09,36.88 66.09,39.32 JP7.8 | v77.83,15.54 84.07,21.79 84.07,22.25 U1.16
  Bottom 0.152: v77.83,15.54 71.42,15.54 70.21,14.33 | 70.21,14.33 JP3.1 69.9,14.02 | 70.21,14.33 68.68,15.85 68.68,19.36 66.09,21.95 66.09,36.73 JP7.9
MOSI
  Top 0.152: 68.53,17.68 68.38,17.68 67.31,16.61 JP3.4 | 68.53,17.68 79.05,17.68 83.16,21.79 83.16,22.25 U1.15 | 68.53,17.68 68.53,23.77 64.87,27.43 64.87,44.96 65.94,46.02 65.94,46.94 JP7.5
N$1
  Top 0.152: U1.7 76.91,24.69 76,24.69 74.17,26.52 73.71,26.52 Y1.1
N$2
  Top 0.152: U1.8 76.91,23.93 73.86,23.93 73.71,24.08 Y1.3
N$3
  Top 0.152: D1.A 91.39,38.56 88.95,38.56 R3.1
N$4
  Top 0.152: D2.A 91.39,34.75 88.95,34.75 R2.1
N$5
  Top 0.152: D3.A 91.39,27.13 88.95,27.13 R4.1
N$6
  Top 0.152: D4.A 91.39,30.94 88.95,30.94 R5.1
N$7
  Top 0.152: U3.7 46.43,24.69 45.52,24.69 43.69,26.52 43.23,26.52 Y2.1
N$8
  Top 0.152: U3.8 46.43,23.93 43.38,23.93 43.23,24.08 Y2.3
N$9
  Top 0.152: D5.A 60.91,34.75 58.47,34.75 R7.1
N$10
  Top 0.152: D6.A 60.91,30.94 58.47,30.94 R9.1
N$11
  Top 0.152: D7.A 60.91,27.13 58.47,27.13 R8.1
N$12
  Top 0.152: R10.P$1 44.45,49.53 JP20.3
N$14
  Bottom 0.152: R11.P$1 52.53,45.72 46.13,52.12 24.18,52.12 22.96,53.34 JP13.3
N$19
  Top 0.152: U4.7 17.17,24.69 15.04,24.69 14.43,25.3 13.97,25.3 Y3.1
N$20
  Top 0.152: U4.8 17.17,23.77 15.19,23.77 14.43,23.01 13.97,23.01 Y3.3
N$21
  Top 0.152: D8.A 31.65,38.56 29.21,38.56 R15.1
N$22
  Top 0.152: D9.A 31.65,34.75 29.21,34.75 R14.1
N$23
  Top 0.152: D10.A 31.65,30.94 29.21,30.94 R17.1
N$24
  Top 0.152: D11.A 31.65,27.13 29.21,27.13 R16.1
RESET  (via drill 0.33)
  Top 0.152: JP3.5 69.9,19.05 70.36,19.51 70.36,24.08 S1.3 70.51,24.23 v70.51,25.45 | v87.12,22.86 88.8,21.18 C1.2 | v81.18,32.16 81.18,31.7 81.03,31.55 81.03,31.09 U1.29 | v78.74,39.17 78.74,68.28 73.41,73.61 15.8,73.61 15.19,73 15.19,71.78 14.43,71.02 14.43,68.58 R1.1
  Bottom 0.152: v87.12,22.86 87.12,26.21 v81.18,32.16 79.2,34.14 | v78.74,39.17 78.74,34.59 79.2,34.14 | 79.2,34.14 v70.51,25.45
RXI
  Top 0.152: 88.04,30.33 88.8,29.57 88.8,28.8 R4.2 | 88.04,30.33 88.04,31.55 88.19,31.7 89.41,31.7 89.71,32 89.71,33.22 89.1,33.83 83.01,33.83 82.09,34.75 81.48,34.75 80.11,33.38 80.11,31.09 U1.30 | JP1.3 82.55,16 84.99,18.44 84.99,23.16 84.68,23.47 84.68,29.87 85.14,30.33 88.04,30.33
SCK
  Top 0.152: JP3.3 73.56,12.8 83.16,12.8 83.77,13.41 83.77,14.33 85.45,16 85.45,23.77 U1.17 | JP7.4 67.46,49.53 80.57,36.42 88.8,36.42 R2.2
  Bottom 0.152: JP3.3 69.9,16.61 69.9,17.37 71.12,18.59 71.12,23.93 67.31,27.74 67.31,48.31 66.09,49.53 JP7.4
SCL  (via drill 0.33)
  Top 0.152: v81.79,34.14 81.79,31.09 U1.28 | JP2.4 JP9.4 JP6.4 | 14.28,3.96 15.19,3.96 15.65,3.5 19,3.5 R19.1 | 14.28,3.96 13.51,3.2 U$1.SCLIN | v26.01,32.16 22.66,32.16 22.05,31.55 22.05,31.09 U4.28 | v50.55,32.16 51.16,31.55 51.16,31.09 U3.28 | v14.28,5.49 14.28,3.96 | v67.92,48.16 65.48,48.16 v56.79,39.47
  Bottom 0.152: v81.79,34.14 81.79,40.69 82.55,41.45 82.55,48.16 | JP9.4 82.55,48.16 | v14.28,5.49 10.16,9.6 10.16,17.98 24.33,32.16 v26.01,32.16 v50.55,32.16 56.79,38.41 v56.79,39.47 | v67.92,48.16 82.55,48.16
SCL3.3  (via drill 0.33)
  Top 0.152: JP4.4 JP5.4 | R20.1 5.13,2.9 6.65,2.9 7.42,2.13 11.23,2.13 12.14,3.05 U$1.SCLOUT 12.14,3.2 12.14,4.27 13.97,6.1 27.08,6.1 27.99,5.18 29.21,5.18 X1.32 | v53.75,50.44 53.75,43.59 40.64,30.48 40.64,26.36 36.83,22.55 v36.83,20.73
  Bottom 0.152: JP5.4 68.07,64.77 v53.75,50.44 | v36.83,20.73 30.28,14.17 30.28,6.25 29.21,5.18 X1.32
SDA  (via drill 0.33)
  Top 0.152: JP2.3 80.11,67.36 82.55,67.36 JP9.3 | v82.55,33.38 82.55,31.09 U1.27 | R18.1 19,7.92 v16.56,7.92 15.65,7.92 15.04,7.32 14.28,7.32 13.36,8.23 U$1.SDAIN | v22.66,29.57 22.66,30.94 U4.27 | v51.16,29.57 51.92,30.33 51.92,30.94 U3.27 52.07,31.09 52.07,31.55 52.83,32.31 v57.1,32.31
  Bottom 0.152: v82.55,33.38 82.55,41 83.92,42.37 83.92,66.14 | JP6.3 83.92,66.14 | 83.92,66.14 82.86,67.21 82.55,67.21 JP9.3 | v16.56,7.92 16.56,23.62 22.2,29.26 22.35,29.26 v22.66,29.57 v51.16,29.57 | v57.1,32.31 58.62,33.83 58.62,46.33 65.63,53.34 66.55,53.34 79.96,66.75 79.96,67.21 JP2.3
SDA3.3  (via drill 0.33)
  Top 0.152: JP5.3 69.9,67.36 72.34,67.36 JP4.3 | 12.14,8.23 10.16,6.25 7.11,6.25 6.65,6.71 5.13,6.71 R12.1 | 29.52,6.25 29.21,6.55 13.82,6.55 12.14,8.23 | 29.52,6.25 30.28,5.49 30.28,4.72 29.52,3.96 28.75,3.96 27.69,5.03 26.77,5.03 X1.34 | 12.14,8.23 U$1.SDAOUT | v46.89,59.74 46.89,59.28 34.7,47.09 34.7,12.04 30.28,7.62 30.28,7.01 29.52,6.25
  Bottom 0.152: v46.89,59.74 46.89,61.27 51.61,65.99 52.53,65.99 53.29,66.75 53.29,67.67 54.2,68.58 62.74,68.58 63.96,67.36 69.75,67.36 JP5.3
TXO  (via drill 0.33)
  Top 0.152: 84.07,30.02 79.65,30.02 79.35,30.33 79.35,30.94 U1.31 | 84.07,30.02 84.38,30.02 86.82,32.46 88.8,32.46 R5.2 | 84.07,30.02 v84.07,28.35
  Bottom 0.152: v84.07,28.35 84.99,27.43 84.99,14.02 JP1.2
VCC  (via drill 0.33)
  Top 0.152: 6.35,13.87 3.61,11.12 3.61,4.72 4.52,3.81 5.74,3.81 6.35,3.2 7.57,3.2 C5.2 | v9.86,8.23 10.77,8.23 U$1.VCCH | 17.93,25.6 17.32,25.6 U4.6 | 17.93,25.6 18.24,25.91 18.24,26.67 17.93,26.98 17.32,26.98 U4.4 | v20.22,2.9 19.15,1.83 R19.2 | 19.15,12.8 19.15,9.75 R18.2 | 19.15,12.8 JP21.4 21.59,15.24 23.27,15.24 24.03,14.48 24.03,13.56 24.79,12.8 28.45,12.8 30.28,14.63 30.28,21.49 29.67,22.1 28.91,22.1 26.47,24.54 26.01,24.54 U4.18 | v19,24.54 17.93,25.6 | 6.35,13.87 7.26,13.87 8.33,12.8 19.15,12.8 | 6.35,13.87 JP22.2 | 4.2 7.72,40.69 7.72,43.13 5.2 7.72,43.28 7.72,45.72 | 9.2 7.72,53.34 7.72,55.78 10.2 | 7.72,47.09 7.72,48.16 7.2 7.72,48.31 7.72,50.75 8.2 | 7.72,47.09 7.72,45.72 | 7.72,45.72 6.2 | 16.1,68.58 16.1,72.39 C16.2 | 29.21,40.23 24.18,40.23 R13.2 | 29.21,40.23 29.52,40.54 29.52,43.13 C9.2 29.52,43.28 28.91,43.89 | 29.21,40.23 R15.2 | 16.1,68.58 16.1,61.42 21.59,55.93 21.59,50.29 22.35,49.53 23.27,49.53 24.64,48.16 | 28.91,43.89 24.64,48.16 | 16.1,68.58 R1.2 | 7.72,47.09 23.57,47.09 24.64,48.16 | R11.P$2 48.26,38.86 41.25,31.85 40.34,31.85 C3.2 40.18,31.7 40.18,30.94 35.46,26.21 35.46,15.39 36.83,14.02 JP11.2 | U3.4 46.43,26.98 45.97,26.98 45.52,26.52 45.52,25.91 45.82,25.6 46.43,25.6 U3.6 46.58,25.45 49.33,25.45 v49.48,25.3 | v53.9,24.69 54.97,24.69 U3.18 | JP2.1 JP9.1 JP6.1 85.14,72.39 85.14,71.48 89.71,66.9 89.71,43.13 88.95,42.37 R6.2 88.95,42.22 88.95,41 | 88.95,41 88.95,40.23 R3.2 | 87.12,23.77 88.04,22.86 88.04,22.71 88.34,22.4 89.41,22.4 92.61,25.6 92.61,40.39 92,41 88.95,41 | 87.12,23.77 86.36,24.54 85.6,24.54 U1.18 | JP3.2 67.31,12.5 | 67.31,12.5 X1.1 | U1.4 76.91,26.98 76.45,26.98 76,26.52 76,25.91 76.3,25.6 76.91,25.6 U1.6 77.06,25.45 82.25,25.45 84.68,23.01 84.68,18.59 80.11,14.02 JP1.4
  Top 0.152: 87.12,23.77 86.36,23.01 86.36,13.56 85.29,12.5 67.31,12.5 | v29.21,44.2 28.91,43.89
  Bottom 0.152: v9.86,8.23 9.86,10.36 6.35,13.87 JP22.2 | 20.22,3.96 20.22,13.87 JP21.4 20.22,14.02 19,15.24 v19,24.54 | 20.22,3.96 v20.22,2.9 | 9.2 7.72,53.34 7.72,50.9 8.2 | 53.9,18.29 v53.9,24.69 53.29,25.3 v49.48,25.3 | 53.9,18.29 49.63,14.02 JP10.4 49.48,13.87 48.11,12.5 38.66,12.5 | 38.66,12.5 37.29,13.87 36.83,13.87 JP11.2 | JP7.1 66.55,57.15 78.74,69.34 78.74,71.17 79.96,72.39 JP2.1 | JP1.4 79.96,13.87 78.89,12.8 69.29,12.8 68.22,13.87 67.31,13.87 JP3.2 67.31,14.02 63.04,18.29 53.9,18.29 | 20.22,3.96 29.52,3.96 30.73,5.18 30.73,5.49 31.34,6.1 32.26,6.1 33.17,5.18 33.17,4.72 33.93,3.96 34.7,3.96 35.76,5.03 35.76,9.6 38.66,12.5 | 7.72,38.1 7.72,35.66 2.2 | 7.72,38.1 7.72,40.54 4.2 | 7.72,38.1 3.2 | v29.21,44.2 46.74,44.2 R11.P$2
VCC3.3
  Top 0.152: JP4.1 JP5.1 64.57,72.39 63.2,71.02 54.05,71.02 53.29,70.26 53.29,69.34 52.53,68.58 51.61,68.58 33.63,50.6 33.63,14.48 26.77,7.62 X1.33 20.98,7.62 19.76,8.84 15.19,8.84 14.73,8.38 U$1.ACC 14.58,8.38 12.29,10.67 10.01,10.67 7.72,8.38 C4.2 7.57,8.38 5.13,8.38 R12.2 4.98,8.53 3.91,7.47 3.91,6.1 4.98,5.03 4.98,4.72 R20.2 5.13,4.57 5.44,4.57 6.2,3.81 8.18,3.81 8.79,3.2 10.77,3.2 U$1.VCCL
VIN
  Top 1.27: U$2.2-2 U$2.2 15.87,60.33 15.87,50.8 18.41,48.26 JP13.5

### Text on the board
tPlace: WildStang Mega Ultra Maxi Board v1.0 Feb 24 2015 | GND | GND | 3.3v | 5v | Vcc | GND | GND | Data | SDA | SDA | Clk | SCL | SCL | Vin | 5v I2C | 3.3v / I2C | GND | 5v | Sig | Vcc | GND | GND | GND | GND | GND | GND | DTR | GND | DTR | GND | DTR